# EAGLE design Cooling1 (EAGLE 7.6.0)
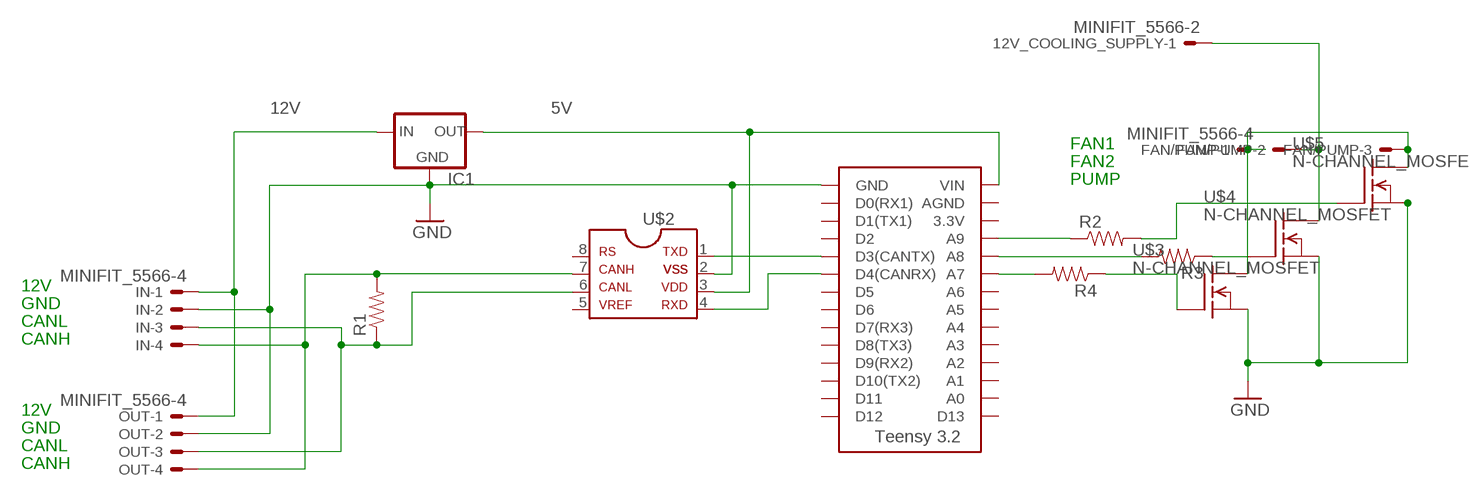
[diagram p0: schematic, sheet 1]

## Parts
12V_COOLING_SUPPLY  MINIFIT_5566-2  [MINIFIT_5566-2]
FAN/PUMP  MINIFIT_5566-4  [MINIFIT_5566-4]
IC1  5V_REGULATOR_LM340-NLM340MPX-5.0/NOPB  [SOT223]
IN  MINIFIT_5566-4  [MINIFIT_5566-4]
OUT  MINIFIT_5566-4  [MINIFIT_5566-4]
R1  RESISTOR0805-RES  [0805]
R2  RESISTOR0805-RES  [0805]
R3  RESISTOR0805-RES  [0805]
R4  RESISTOR0805-RES  [0805]
U$1  TEENSY_3.2_SIMPLE  [TEENSY_3.2_SIMPLE]
U$2  MCP2551SOIC  [SOIC08]
U$3  N-CHANNEL_MOSFET  (no package)
U$4  N-CHANNEL_MOSFET  (no package)
U$5  N-CHANNEL_MOSFET  (no package)

## Nets
5V: U$1.VIN U$2.3
12V: IC1.3(IN) IN.1 OUT.1
12V_COOLING_SUPPLY: FAN/PUMP.1 FAN/PUMP.3 U$3.D U$5.D
GND: IC1.1(GND) IN.2 OUT.2 U$1.GND U$2.2 U$3.S U$4.S U$5.S
N$1: R4.2 U$1.A7
N$2: U$1.D3(CANTX) U$2.1
N$3: U$1.D4(CANRX) U$2.4
N$4: R2.2 U$5.G
N$5: U$2.6
N$6: R4.1 U$3.G
N$8: IN.3 OUT.3 R1.1
N$9: R2.1 U$1.A9
N$10: 12V_COOLING_SUPPLY.1 FAN/PUMP.2 U$4.D
N$11: IN.4 OUT.4 R1.2 U$2.7
N$12: R3.2 U$1.A8
N$17: R3.1 U$4.G
Unconnected: 12V_COOLING_SUPPLY.2 FAN/PUMP.4 IC1.2(OUT) IC1.4(OUT) U$1.3.3V U$1.A0 U$1.A1 U$1.A2 U$1.A3 U$1.A4 U$1.A5 U$1.A6 U$1.AGND U$1.D0(RX1) U$1.D1(TX1) U$1.D2 U$1.D5 U$1.D6 U$1.D7(RX3) U$1.D8(TX3) U$1.D9(RX2) U$1.D10(TX2) U$1.D11 U$1.D12 U$1.D13 U$2.5 U$2.8

## Notes on the sheet
- FAN1
- FAN2
- PUMP
- 12V
- GND
- CANL
- CANH
- 12V
- GND
- CANL
- CANH

## Library data of the parts
12V_COOLING_SUPPLY = HyTechDevices:MINIFIT_5566-2: Mini FIT Junior connector 2 pole Source: http://www.molex.com; OC_FARNELL: 1822072; OC_NEWARK: unknown
FAN/PUMP IN OUT = HyTechDevices:MINIFIT_5566-4: Mini FIT Junior connector 4 pole Source: http://www.molex.com; OC_FARNELL: unknown; OC_NEWARK: unknown
IC1 = HyTechDevices:5V_REGULATOR_LM340-N: Voltage Regulator 5v linear voltage regulator Datasheet <http://www.mouser.com/ProductDetail/Texas-Instruments/LM340MPX-50-NOPB/?qs=X1J7HmVL2ZGZwtTFRQ9ItA%3D%3D> MAX current out: 1.5A MAX voltage in: 35V
R1-R4 = HyTechDevices:RESISTOR: Resistor Basic schematic elements and footprints for 0603, 1206, and PTH resistors.
U$1 = HyTechDevices:TEENSY_3.2_SIMPLE: Simple version of the Teensy 3.2 board that only uses the 2 main rows of pins, not the inner pins or the pins opposite the usb port.
U$2 = HyTechDevices:MCP2551: MCP2551 High-Speed CAN Transceiver Product Webpage <https://www.microchip.com/wwwproducts/en/MCP2551> Datasheet <http://ww1.microchip.com/downloads/en/DeviceDoc/21667f.pdf> This device is outdated It is replaced by MCP2561. Comparison Page <https://www.microchip.com/wwwproducts/ProductCompare/MCP2551/MCP2561> Product Webpage <https://www.microchip.com/wwwproducts/en/MCP2561> Datasheet <http://ww1.microchip.com/downloads/en/DeviceDoc/20005167C.pdf>
U$3-U$5 = HyTechDevices:N-CHANNEL_MOSFET; _EXTERNAL_: 1

## Board
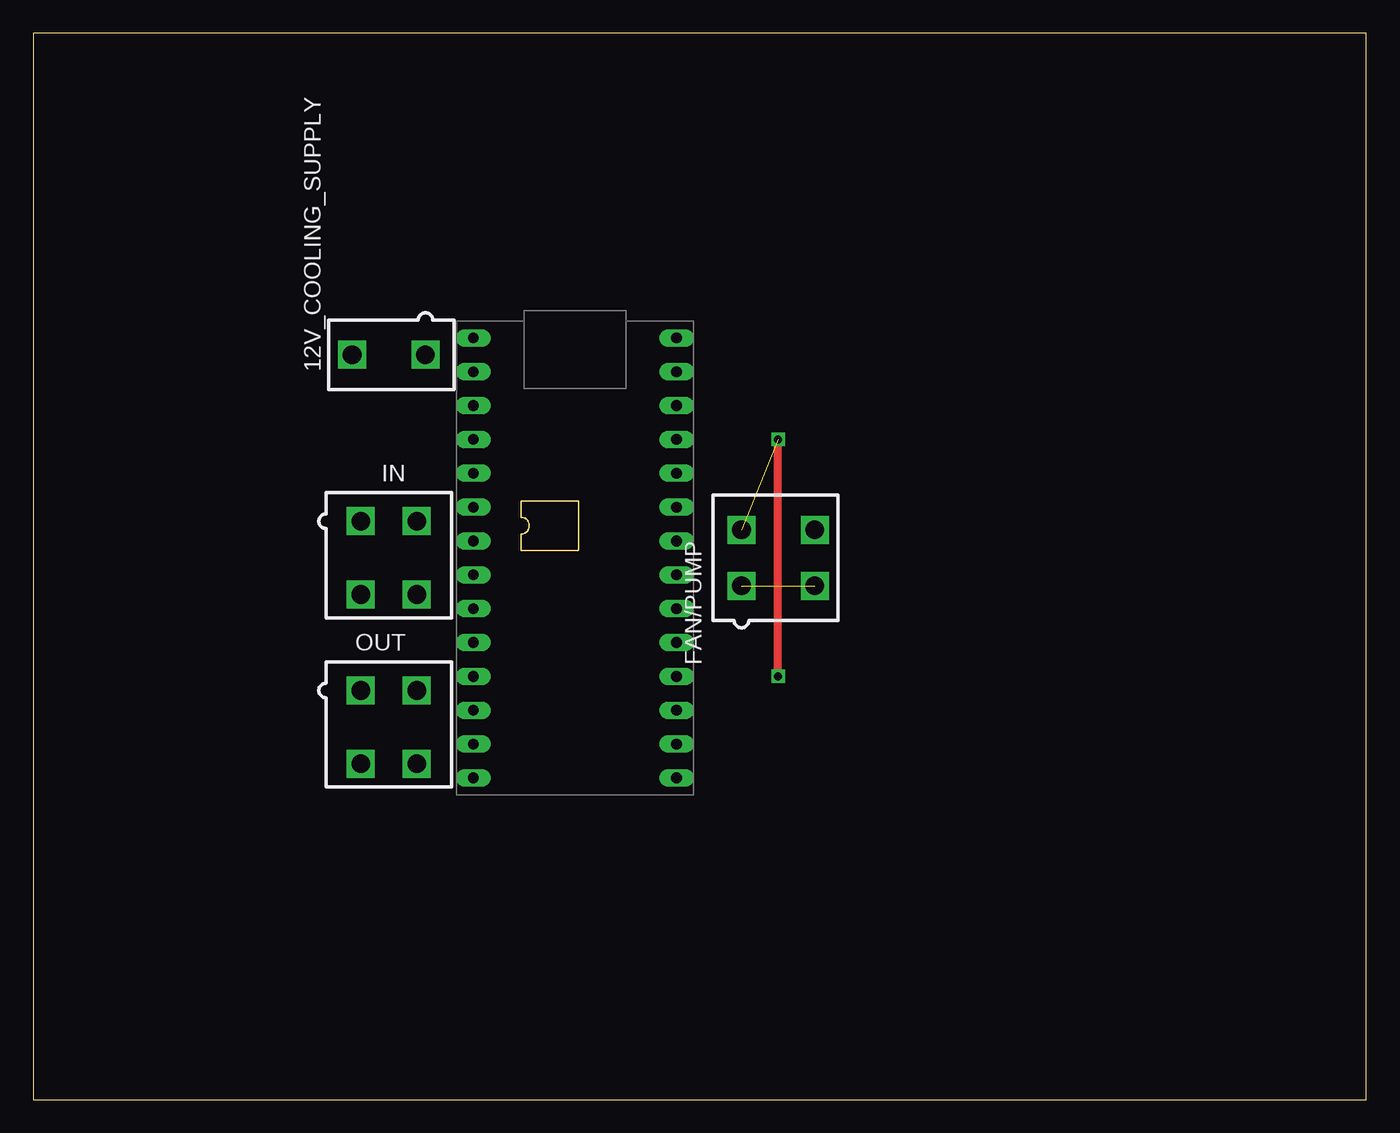
[diagram p1: board, top side]
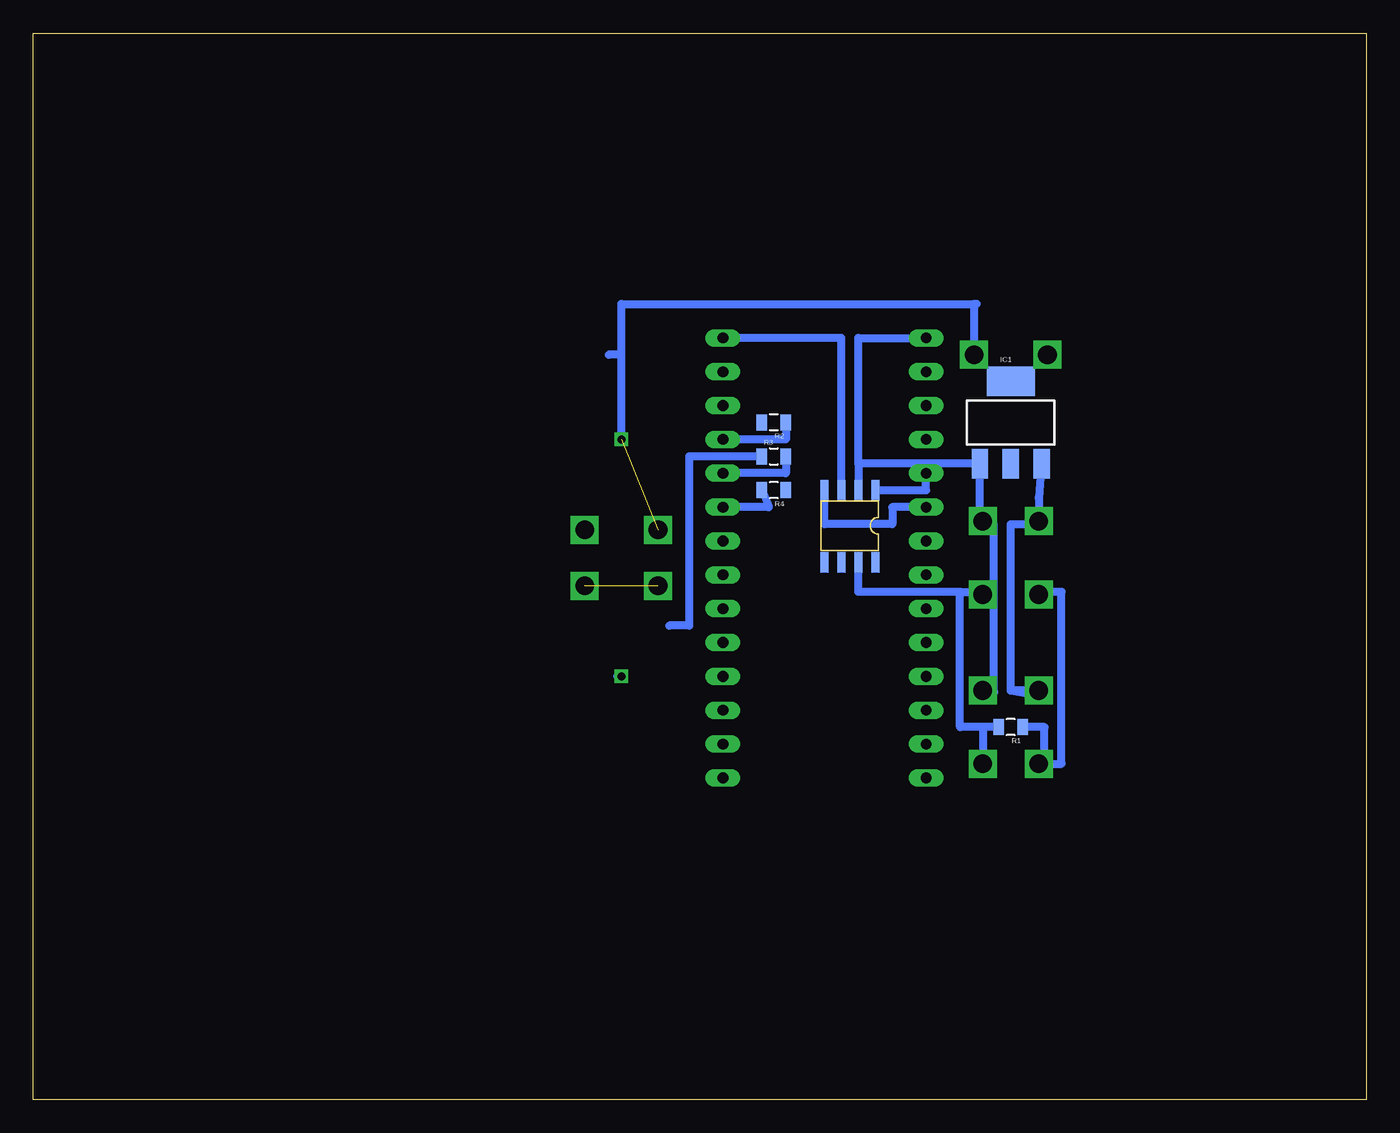
[diagram p2: board, bottom side, seen from below]

Size 100 x 80 mm. Coordinates in mm from the lower left corner, seen from the top.
Outline: 0,0 100,0 100,80 0,80 0,0
Copper layers (1*16): Top 0.035mm / dielectric 1.5mm / Bottom 0.035mm
Design rules "default": minimum track width 10mil, minimum drill 24mil, track to track 8mil, track to pad 8mil, pad to pad 8mil, via to via 8mil, smd to smd 8mil, copper to edge 40mil, drill to drill 8mil, minimum pad ring 10mil, minimum via ring 8mil, stop-mask expansion 4mil, vias tented up to drill 0mil, thermal gap 10mil

### Footprints (pad centres in the part's own frame; a part is rotated, then mirrored left to right if it is on the bottom)
MINIFIT_5566-2 = drill 1.4 square: 1 0,-2.75; 2 0,2.75
MINIFIT_5566-4 = drill 1.4 square: 1 2.1,-2.75; 2 -2.1,-2.75; 3 2.1,2.75; 4 -2.1,2.75
SOT223 = smd 1.219 x 2.235: 1 -2.311,-3.099; 2 0,-3.099; 3 2.311,-3.099 | smd 3.6 x 2.2: 4 0,3.099
0805 = smd 0.8 x 1.2: 1 -0.9,0; 2 0.9,0
TEENSY_3.2_SIMPLE = drill 0.8 long: 3.3V 16.51,29.21; A0 16.51,3.81; A1 16.51,6.35; A2 16.51,8.89; A3 16.51,11.43; A4 16.51,13.97; A5 16.51,16.51; A6 16.51,19.05; A7 16.51,21.59; A8 16.51,24.13; A9 16.51,26.67; AGND 16.51,31.75; D0(RX1) 1.27,31.75; D1(TX1) 1.27,29.21; D2 1.27,26.67; D3(CANTX) 1.27,24.13; D4(CANRX) 1.27,21.59; D5 1.27,19.05; D6 1.27,16.51; D7(RX3) 1.27,13.97; D8(TX3) 1.27,11.43; D9(RX2) 1.27,8.89; D10(TX2) 1.27,6.35; D11 1.27,3.81; D12 1.27,1.27; D13 16.51,1.27; GND 1.27,34.29; VIN 16.51,34.29
SOIC08 = smd 0.6 x 1.55: 1 0,0; 2 1.27,0; 3 2.54,0; 4 3.81,0; 5 3.81,5.4; 6 2.54,5.4; 7 1.27,5.4; 8 0,5.4

### Placement (x,y rotation side)
12V_COOLING_SUPPLY  26.67,55.88 90 top
FAN/PUMP  55.88,40.64 270 top
IC1  26.67,50.8 0 bottom
IN  26.67,40.64 180 top
OUT  26.67,27.94 180 top
R1  26.67,27.94 180 bottom
R2  44.45,50.8 180 bottom
R3  44.45,48.26 0 bottom
R4  44.45,45.72 180 bottom
U$1  31.75,22.86 0 top
U$2  36.83,45.72 180 bottom

### Tracks (layer width: path | path; a pad name or v marks a point on that pad's centre or on a via)
5V
  Bottom 0.61: U$2.3 39.37,57.15 U$1.VIN
12V
  Bottom 0.61: OUT.1 26.67,30.69 | 26.67,30.69 25.4,30.48 | 26.67,30.69 26.67,43.18 24.57,43.18 IN.1 24.57,45.16 IC1.3
12V_COOLING_SUPPLY  (1 unrouted)
GND
  Bottom 0.61: OUT.2 27.94,30.69 | 27.94,30.69 27.94,30.48 | 27.94,30.69 27.94,43.18 28.77,43.18 IN.2 28.98,43.39 IC1.1 38.1,47.7 | 38.1,47.7 U$2.2 | 38.1,47.7 38.1,57.15 U$1.GND
N$1
  Bottom 0.61: R4.2 44.82,44.45 U$1.A7
N$2
  Bottom 0.61: U$2.1 33.02,45.72 U$1.D3(CANTX)
N$3
  Bottom 0.61: U$1.D4(CANRX) 35.56,44.45 35.56,43.18 40.64,43.18 U$2.4
N$8
  Bottom 0.61: 24.13,25.19 24.13,27.94 R1.1 | OUT.3 24.13,25.19 | 24.13,25.19 22.86,25.19 22.86,38.1 24.57,38.1 IN.3
N$9
  Bottom 0.61: R2.1 43.55,49.53 44.45,49.53 U$1.A9
N$10  (via drill 0.6)  (1 unrouted)
  Top 0.61: v55.88,31.75 v55.88,49.53
  Bottom 0.61: 56.2,31.75 v55.88,31.75 | v55.88,49.53 55.88,55.88 | 55.88,55.88 55.88,59.69 29.42,59.69 | 29.21,59.69 29.42,59.69 | 29.42,59.69 12V_COOLING_SUPPLY.1 | 55.88,55.88 56.83,55.88
N$11
  Bottom 0.61: R1.2 28.77,27.94 | 28.77,27.94 OUT.4 | 28.77,27.94 30.48,27.94 30.48,38.1 | 30.48,38.1 28.77,38.1 IN.4 | 30.48,38.1 38.1,38.1 U$2.7
N$12
  Bottom 0.61: R3.2 43.55,46.99 U$1.A8
N$17
  Bottom 0.61: R3.1 50.8,48.26 50.8,35.56 52.3,35.56